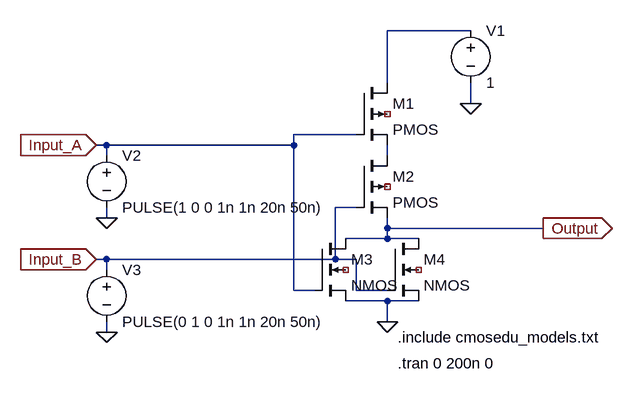
[diagram p0: schematic EXP_5 (NOR).asc]
EXP_5 (NOR).asc, the LTspice schematic file:
Version 4
SHEET 1 880 680
WIRE 336 -64 208 -64
WIRE 208 16 208 -64
WIRE 336 48 336 16
WIRE 160 96 64 96
WIRE -224 112 -240 112
WIRE 64 112 64 96
WIRE 64 112 -224 112
WIRE -224 128 -224 112
WIRE 208 128 208 112
WIRE 160 208 128 208
WIRE -224 224 -224 208
WIRE 208 240 208 224
WIRE 448 240 208 240
WIRE 208 256 208 240
WIRE 208 256 144 256
WIRE 256 256 208 256
WIRE -224 288 -240 288
WIRE 128 288 128 208
WIRE 128 288 -224 288
WIRE 160 288 128 288
WIRE -224 304 -224 288
WIRE 64 336 64 112
WIRE 96 336 64 336
WIRE 160 336 160 288
WIRE 208 336 160 336
WIRE 208 352 144 352
WIRE 256 352 208 352
WIRE 208 384 208 352
WIRE -224 400 -224 384
FLAG 336 48 0
FLAG 208 384 0
FLAG -240 112 Input_A
IOPIN -240 112 In
FLAG -240 288 Input_B
IOPIN -240 288 In
FLAG 448 240 Output
IOPIN 448 240 Out
FLAG -224 224 0
FLAG -224 400 0
SYMBOL pmos4 160 16 R0
SYMATTR InstName M1
SYMBOL pmos4 160 128 R0
SYMATTR InstName M2
SYMBOL nmos4 96 256 R0
SYMATTR InstName M3
SYMBOL nmos4 208 256 R0
SYMATTR InstName M4
SYMBOL voltage 336 -80 R0
SYMATTR InstName V1
SYMATTR Value 1
SYMBOL voltage -224 112 R0
WINDOW 123 0 0 Left 0
WINDOW 39 0 0 Left 0
SYMATTR InstName V2
SYMATTR Value PULSE(1 0 0 1n 1n 20n 50n)
SYMBOL voltage -224 288 R0
WINDOW 123 0 0 Left 0
WINDOW 39 0 0 Left 0
SYMATTR InstName V3
SYMATTR Value PULSE(0 1 0 1n 1n 20n 50n)
TEXT 224 408 Left 2 !.include cmosedu_models.txt
TEXT 224 448 Left 2 !.tran 0 200n 0

The netlist it stands for:
* EXP_5 (NOR).asc
M1 N001 Input_A N002 NC_01 PMOS
M2 N002 Input_B Output NC_02 PMOS
M3 Output Input_A 0 NC_03 NMOS
M4 Output Input_B 0 NC_04 NMOS
V1 N001 0 1
V2 Input_A 0 PULSE(1 0 0 1n 1n 20n 50n)
V3 Input_B 0 PULSE(0 1 0 1n 1n 20n 50n)
.model NMOS NMOS
.model PMOS PMOS
.lib standard.mos
.include cmosedu_models.txt
.tran 0 200n 0
.backanno
.end